# Altium schematic sheet System.SchDoc
size 420 x 297 mm; SheetNumber: 1; SheetTotal: 9
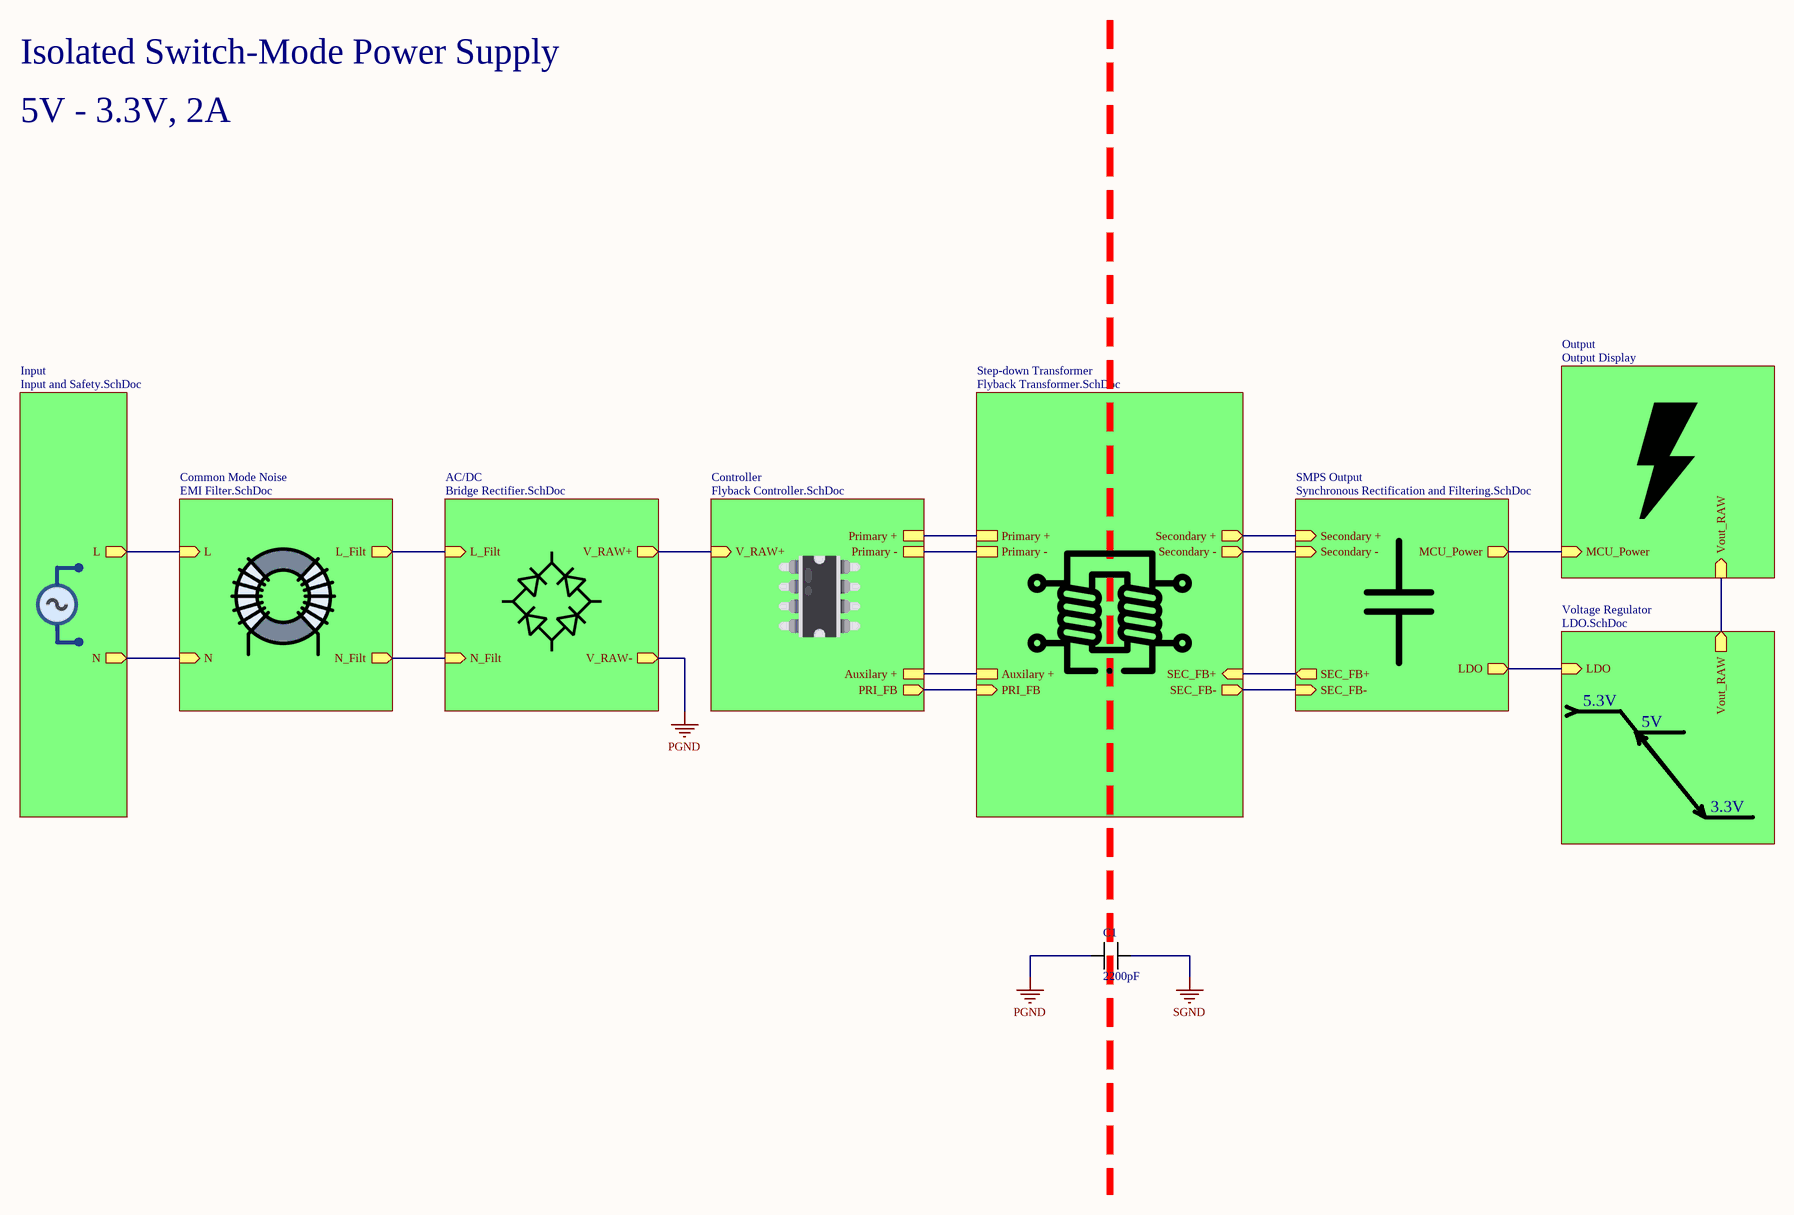
[diagram p0: System.SchDoc]

## Parts
C1  2200pF  [C927U222MYWDBA7317]

## Sub-sheets
AC/DC = Bridge Rectifier.SchDoc: V_RAW+ (out), V_RAW- (out), L_Filt (in), N_Filt (in)
Common Mode Noise = EMI Filter.SchDoc: L (in), N (in), L_Filt (out), N_Filt (out)
Controller = Flyback Controller.SchDoc: V_RAW+ (in), Auxilary +, Primary +, Primary -, PRI_FB (out)
Input = Input and Safety.SchDoc: L (out), N (out)
Output = Output Display: Vout_RAW (in), MCU_Power (in)
SMPS Output = Synchronous Rectification and Filtering.SchDoc: Secondary + (in), Secondary - (in), SEC_FB+ (out), SEC_FB- (in), LDO (out), MCU_Power (out)
Step-down Transformer = Flyback Transformer.SchDoc: Auxilary +, Primary +, Primary -, Secondary - (out), SEC_FB- (out), Secondary + (out), PRI_FB (in), SEC_FB+ (in)
Voltage Regulator = LDO.SchDoc: LDO (in), Vout_RAW (out)

## Nets
PGND: C1.1 ; sheet AC/DC/V_RAW-
SGND: C1.2
(unnamed): sheet Input/L, sheet Common Mode Noise/L
(unnamed): sheet Input/N, sheet Common Mode Noise/N
(unnamed): sheet Common Mode Noise/L_Filt, sheet AC/DC/L_Filt
(unnamed): sheet Common Mode Noise/N_Filt, sheet AC/DC/N_Filt
(unnamed): sheet AC/DC/V_RAW+, sheet Controller/V_RAW+
(unnamed): sheet Controller/Auxilary +, sheet Step-down Transformer/Auxilary +
(unnamed): sheet Controller/Primary +, sheet Step-down Transformer/Primary +
(unnamed): sheet Controller/Primary -, sheet Step-down Transformer/Primary -
(unnamed): sheet Controller/PRI_FB, sheet Step-down Transformer/PRI_FB
(unnamed): sheet Step-down Transformer/Secondary -, sheet SMPS Output/Secondary -
(unnamed): sheet Step-down Transformer/SEC_FB-, sheet SMPS Output/SEC_FB-
(unnamed): sheet Step-down Transformer/Secondary +, sheet SMPS Output/Secondary +
(unnamed): sheet Step-down Transformer/SEC_FB+, sheet SMPS Output/SEC_FB+
(unnamed): sheet Output/Vout_RAW, sheet Voltage Regulator/Vout_RAW
(unnamed): sheet Output/MCU_Power, sheet SMPS Output/MCU_Power
(unnamed): sheet SMPS Output/LDO, sheet Voltage Regulator/LDO

## Notes on the sheet
- Isolated Switch-Mode Power Supply
- 5V - 3.3V, 2A
- 5.3V
- 5V
- 3.3V
- THIS DOCUMENT AND THE DATA DISCLOSED HEREIN OR
- HEREWITH IS THE PROPERTY OF ALTIUM LIMITED AND MAY
- DWG NO:
- REVISION
- REV:
- DESCRIPTION
- DATE
- APPROVED
- BE FREELY DISTRIBUTED IN WHOLE. NO RIGHTS ARE
- RESERVED OR EXPRESS OR IMPLIED WARANTEE GIVEN.
- ENG:
- APPROVALS
- PROJECT
- DSN:
- CHK:
- REFERENCE DOCUMENTS
- PROJECT REVISION:
- TITLE
- DOCUMENT REVISION:
- DESIGN ITEM:
- BOM:
- FAB DWG:
- PCB DWG:
- ASSY DWG:
- SCALE:
- A3
- SIZE
- CAGE CODE
- FILE NAME
- DWG NO.
- SHEET
- OF
- REV

## Library data of the parts
C1 = C927U222MYWDBA7317: Safety Capacitors 400/250V 2200pF Y5U 20% LS=7.5mm; Supplier 1: Mouser; Supplier Part Number 1: 80-C927U222MYWDBAP